# EAGLE design minidoxs-ctrl-lz (EAGLE 9.5.0)
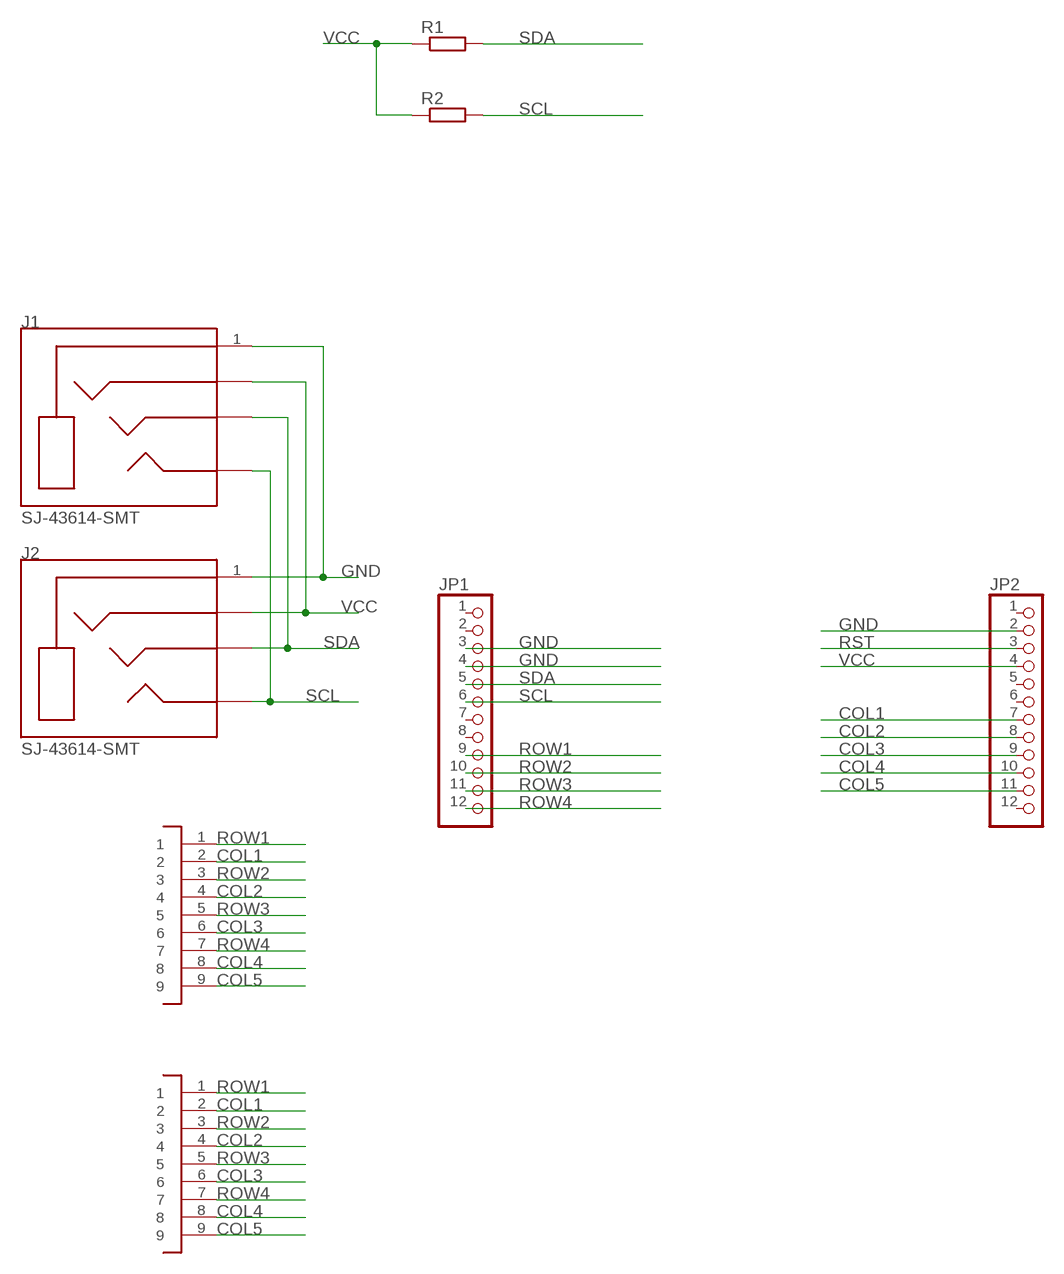
[diagram p0: schematic, sheet 1]

## Parts
J1  SJ-43614-SMT  [CUI_SJ-43614-SMT]
J2  SJ-43614-SMT  [CUI_SJ-43614-SMT]
JP1  PINHD-1X12  [1X12]
JP2  PINHD-1X12  [1X12]
R1  RESISTOR-0603  [R0603]
R2  RESISTOR-0603  [R0603]
U$1  HEADER-9X1-2.54  [HEADER-9X1-2.54]
U$2  HEADER-9X1-2.54  [HEADER-9X1-2.54]

## Nets
COL1: JP2.7 U$1.2 U$2.2
COL2: JP2.8 U$1.4 U$2.4
COL3: JP2.9 U$1.6 U$2.6
COL4: JP2.10 U$1.8 U$2.8
COL5: JP2.11 U$1.9 U$2.9
GND: J1.1(SLEEVE) J2.1(SLEEVE) JP1.3 JP1.4 JP2.2
ROW1: JP1.9 U$1.1 U$2.1
ROW2: JP1.10 U$1.3 U$2.3
ROW3: JP1.11 U$1.5 U$2.5
ROW4: JP1.12 U$1.7 U$2.7
RST: JP2.3
SCL: J1.2(TIP) J2.2(TIP) JP1.6 R2.2
SDA: J1.3(RING1) J2.3(RING1) JP1.5 R1.2
VCC: J1.4(RING2) J2.4(RING2) JP2.4 R1.1 R2.1
Unconnected: JP1.1 JP1.2 JP1.7 JP1.8 JP2.1 JP2.5 JP2.6 JP2.12

## Library data of the parts
J1 J2 = SJ-43614-SMT:SJ-43614-SMT: 4 Conductor 3.5 mm Mid Mount SMT Audio Jack; MANUFACTURER: CUI INC; PART_REV: 1.04; STANDARD: MANUFACTURER RECOMMENDATIONS
JP1 JP2 = pinhead:PINHD-1X12: PIN HEADER
R1 R2 = Components:RESISTOR
U$1 U$2 = Controller:HEADER-9X1

## Board
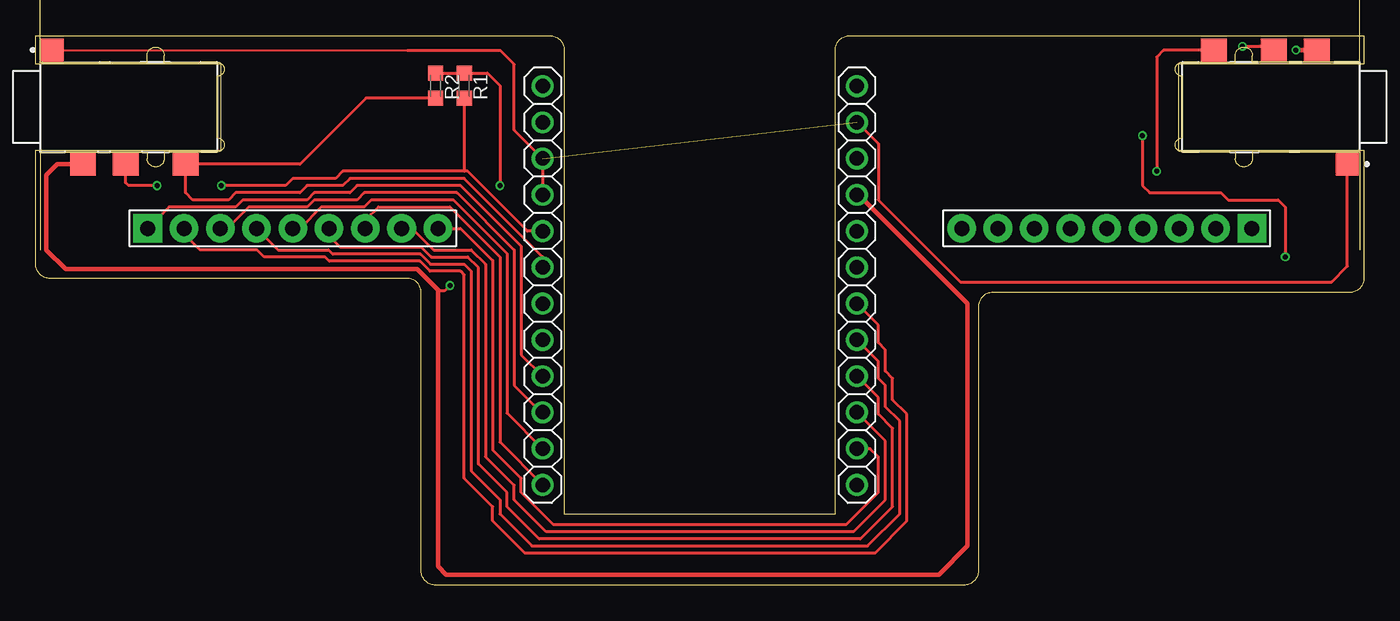
[diagram p1: board, top side]
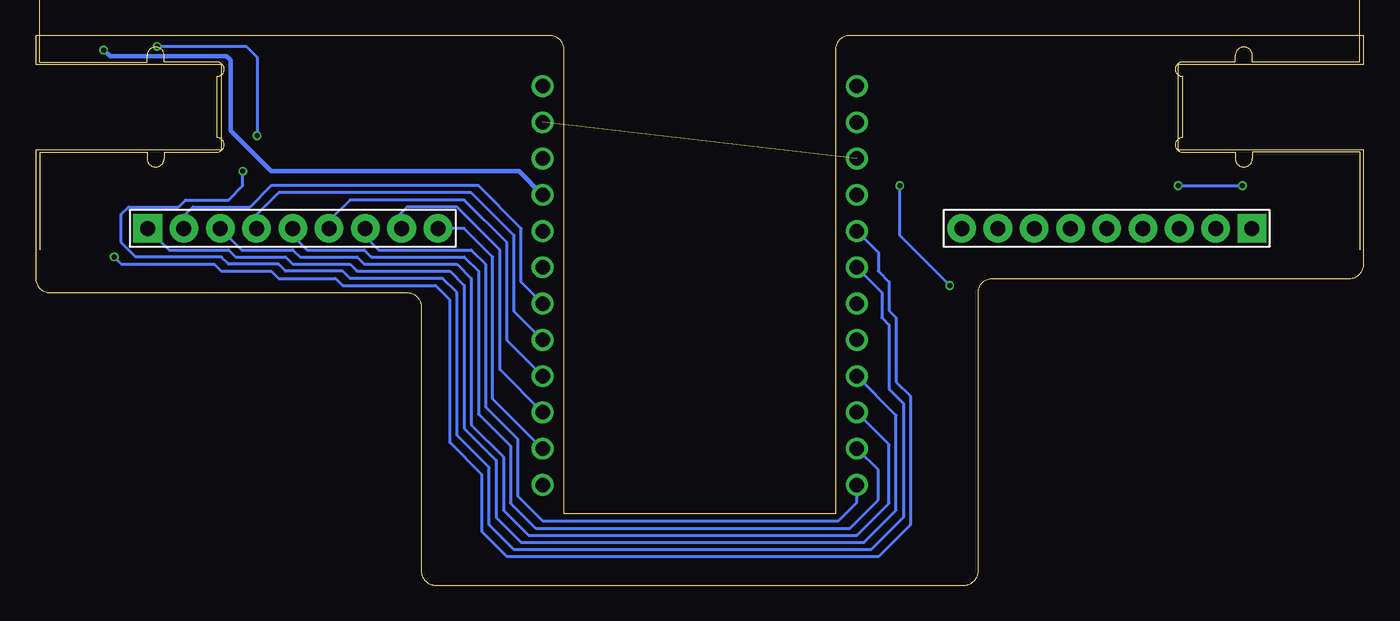
[diagram p2: board, bottom side, seen from below]

Size 93 x 38.5 mm. Coordinates in mm from the lower left corner, seen from the top.
Outline: 0,38.5 36,38.5 arc-90 37,37.5 37,5 56,5 56,37.5 arc-90 57,38.5 93,38.5 93,36.5 80,36.5 80,30.5 93,30.5 93,21.5 arc-90 92,20.5 67,20.5 arc90 66,19.5 66,1 arc-90 65,0 28,0 arc-90 27,1 27,20.5 arc90 26,21.5 1,21.5 arc-90 0,22.5 0,30.5 13,30.5 13,36.5 0,36.5 0,38.5
Copper layers (1*16): Top 0.035559375mm / dielectric 1.6mm / Bottom 0.035559375mm
Design rules "oshpark-2layer": minimum track width 6mil, minimum drill 10mil, track to track 6mil, track to pad 6mil, pad to pad 6mil, via to via 6mil, smd to smd 6mil, copper to edge 15mil, drill to drill 6mil, minimum pad ring 5mil, minimum via ring 5mil, stop-mask expansion 2.5mil, vias tented up to drill 0mil, thermal gap 10mil

### Footprints (pad centres in the part's own frame; a part is rotated, then mirrored left to right if it is on the bottom)
CUI_SJ-43614-SMT = smd 1.6 x 1.65: 1 -5.35,3.975 | smd 1.8 x 1.65: 2 4,-3.975; 3 -0.2,-3.975; 4 -3.2,-3.975
1X12 = drill 1.016: 1 -13.97,0; 2 -11.43,0; 3 -8.89,0; 4 -6.35,0; 5 -3.81,0; 6 -1.27,0; 7 1.27,0; 8 3.81,0; 9 6.35,0; 10 8.89,0; 11 11.43,0; 12 13.97,0
R0603 = smd 1.05 x 1.08: 1 -0.875,0; 2 0.875,0
HEADER-9X1-2.54 = drill 1.05 pad 2 square: 1 -10.16,0 | drill 1.05 pad 2: 2 -7.62,0; 3 -5.08,0; 4 -2.54,0; 5 0,0; 6 2.54,0; 7 5.08,0; 8 7.62,0; 9 10.16,0

### Placement (x,y rotation side)
J1  86.5,33.5 180 top
J2  6.5,33.5 0 top
JP1  35.5,21 270 top
JP2  57.5,21 270 top
R1  30,35 270 top
R2  28,35 270 top
U$1  18,25 0 top
U$2  75,25 180 top

### Tracks (layer width: path | path; a pad name or v marks a point on that pad's centre or on a via)
COL1
  Top 0.2: U$1.2 10.38,24.62 11.5,23.5 15.5,23.5 16,23 20.25,23 20.55,22.7 26.9,22.7 27.6,22 29.75,22 30,21.75 30,7.5 32,5.5 32,4.5 34.25,2.25 58.75,2.25 61,4.5 61,12 60,13 60,14.5 59.5,15 59.5,16.5 59,17 59,18.23 JP2.7
  Bottom 0.2: JP2.7 59,21.23 59,25 62,28 76.5,28 78,26.5 82,26.5 82.62,25.88 U$2.2
COL2
  Top 0.2: U$1.4 16.96,23.5 20.5,23.5 20.8,23.2 26.95,23.2 27.65,22.5 30,22.5 30.5,22 30.5,8 32.5,6 32.5,5 34.75,2.75 58.25,2.75 60.5,5 60.5,11.5 59.5,12.5 59.5,14 59,14.5 59,15.69 JP2.8
  Bottom 0.2: JP2.8 59.5,19.19 59.5,24.5 62.5,27.5 76,27.5 77.54,25.96 U$2.4
COL3
  Top 0.2: U$1.6 20.54,24.46 21.3,23.7 27,23.7 27.7,23 30.25,23 31,22.25 31,8.5 33,6.5 33,5.5 35.25,3.25 57.75,3.25 60,5.5 60,11 59,12 59,13.15 JP2.9
  Bottom 0.2: JP2.9 60,17.15 60,24 63,27 71,27 72.5,25.5 72.5,25.04 U$2.6
COL4
  Top 0.2: U$1.8 26.37,25 27.87,23.5 30.5,23.5 31.5,22.5 31.5,9 33.5,7 33.5,6 35.75,3.75 57.25,3.75 59.5,6 59.5,10.11 JP2.10
  Bottom 0.2: JP2.10 60.5,15.11 60.5,23.5 63.5,26.5 67,26.5 67.5,26 67.5,25.12 U$2.8
COL5
  Top 0.2: JP2.11 58.43,9.57 59,9 59,6.5 56.75,4.25 36.25,4.25 34,6.5 34,7.5 32,9.5 32,22.75 29.75,25 U$1.9
  Bottom 0.2: JP2.11 61,13.07 61,23 63,25 U$2.9
GND  (1 unrouted)
  Top 0.152: J2.1 26.02,37.48
  Top 0.2: JP2.2 59,30.93 59,27 64.75,21.25 90.75,21.25 91.85,22.35 J1.1 | JP1.4 JP1.3 33.5,31.89 33.5,36.5 32.52,37.48 26.02,37.48
ROW1
  Top 0.2: U$1.1 9.34,26.5 14,26.5 14.5,27 19,27 19.5,27.5 22,27.5 22.5,28 29.75,28 34,23.75 34,16.15 JP1.9
  Bottom 0.2: U$2.1 83.66,23.5 79.5,23.5 79,23 75.5,23 75,22.5 71,22.5 70.5,22 64,22 63,21 63,11 60.75,8.75 60.75,4.75 59,3 35,3 32.75,5.25 32.75,11.9 JP1.9
ROW2
  Top 0.2: JP1.10 35.45,12.05 33.5,14 33.5,23.5 29.5,27.5 23,27.5 22.5,27 19.5,27 19,26.5 14.92,26.5 13.42,25 U$1.3
  Bottom 0.2: U$2.3 78.58,23.5 75,23.5 74.5,23 70.5,23 70,22.5 63.5,22.5 62.5,21.5 62.5,11.25 60.25,9 60.25,5.25 58.5,3.5 35.5,3.5 33.25,5.75 33.25,9.86 JP1.10
ROW3
  Top 0.2: U$1.5 18.5,25 20,26.5 23,26.5 23.5,27 29.25,27 33,23.25 33,12.07 JP1.11
  Bottom 0.2: U$2.5 75,24.5 74,23.5 70,23.5 69.5,23 63,23 62,22 62,12 59.75,9.75 59.75,5.75 58,4 36,4 34,6 34,8.07 JP1.11
ROW4
  Top 0.2: U$1.7 23.08,25.58 24,26.5 29,26.5 32.5,23 32.5,10.03 JP1.12
  Bottom 0.2: U$2.7 69.92,24.42 69,23.5 62.5,23.5 61.5,22.5 61.5,12.5 59.25,10.25 59.25,6.25 57.5,4.5 36.8,4.5 35.5,5.8 JP1.12
SCL  (via drill 0.35)
  Top 0.2: 10.5,29.5 10.5,27.5 11,27 13.5,27 14,27.5 18.5,27.5 19,28 21.5,28 22,28.5 30,28.5 35.5,23 JP1.6 | 10.5,29.5 J2.2 | J1.2 78.97,37.48 78.5,37 v78.5,29 | R2.2 23.12,34.12 18.5,29.5 10.5,29.5
  Bottom 0.2: JP1.6 33.75,20.52 33.75,18.75 33.25,18.25 33.25,13.75 32.25,12.75 32.25,4.75 34.5,2.5 59.5,2.5 61.25,4.25 61.25,8.25 63.5,10.5 63.5,20.5 64.5,21.5 71,21.5 71.5,22 75.5,22 76,22.5 79.5,22.5 80,23 86,23 87,24 87,26 86.5,26.5 83,26.5 82.5,27 79.5,27 78.5,28 v78.5,29
SDA  (via drill 0.35)
  Top 0.2: JP1.5 34.44,24.81 30.25,29 30,29 | 30,29 21.5,29 21,28.5 18,28.5 17.5,28 v13,28 | v8.5,28 6.5,28 6.3,28.2 J2.3 | v77.5,31.5 77.5,28 78,27.5 83,27.5 83.5,27 87,27 87.5,26.5 v87.5,23 | R1.2 30,29 | 86.43,37.75 J1.3 86.42,37.75 v84.5,37.75
  Bottom 0.2: v13,28 v8.5,28 | JP1.5 34,23.31 34,22 33.25,21.25 33.25,19.25 32.75,18.75 32.75,14.25 31.75,13.25 31.75,4.25 34,2 60,2 61.75,3.75 61.75,7.75 64,10 64,20 65,21 71.5,21 72,21.5 76,21.5 76.5,22 80,22 80.5,22.5 87,22.5 v87.5,23 | v84.5,37.75 78.25,37.75 77.5,37 v77.5,31.5
VCC  (via drill 0.35)
  Top 0.2: R2.1 R1.1 31.62,35.88 32.5,35 v32.5,28 | v29,21 28.62,20.62 28.23,20.62
  Top 0.3: 3.27,29.5 1.5,29.5 0.75,28.75 0.75,23.5 2.1,22.15 26.7,22.15 28.18,20.68 | 28.18,20.68 28.23,20.62 | 57.65,27.35 65.25,19.75 65.25,2.75 63.25,0.75 28.75,0.75 28.18,1.32 28.18,20.68 | 89.67,37.5 v88.25,37.5
  Top 0.508: J2.4 3.27,29.5 | JP2.4 57.65,27.35 | J1.4 89.67,37.5
  Bottom 0.2: v29,21 32.5,24.5 v32.5,28
  Bottom 0.3: v88.25,37.5 87.8,37.05 79.63,37.05 79.35,36.77 79.35,31.85 76.5,29 59.15,29 JP2.4